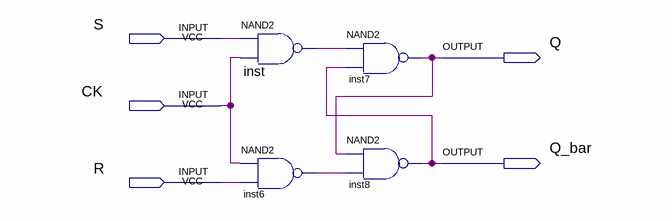
[diagram p0: schematic sheet]
// Quartus schematic RS_FF_NAND.bdf as structural Verilog: 4 symbols, 5 pins
module RS_FF_NAND (
  input  S,
  input  CK,
  input  R,
  output Q,
  output Q_bar
);

  wire inst6_out, inst_out;

  nand inst (inst_out, S, CK);
  nand inst6 (inst6_out, CK, R);
  nand inst7 (Q, inst_out, Q_bar);
  nand inst8 (Q_bar, Q, inst6_out);
endmodule
